# EasyEDA Pro project Space_Hexapod.eprj, schematic Power
Board Name: Power; Create Date: 2025-05-06
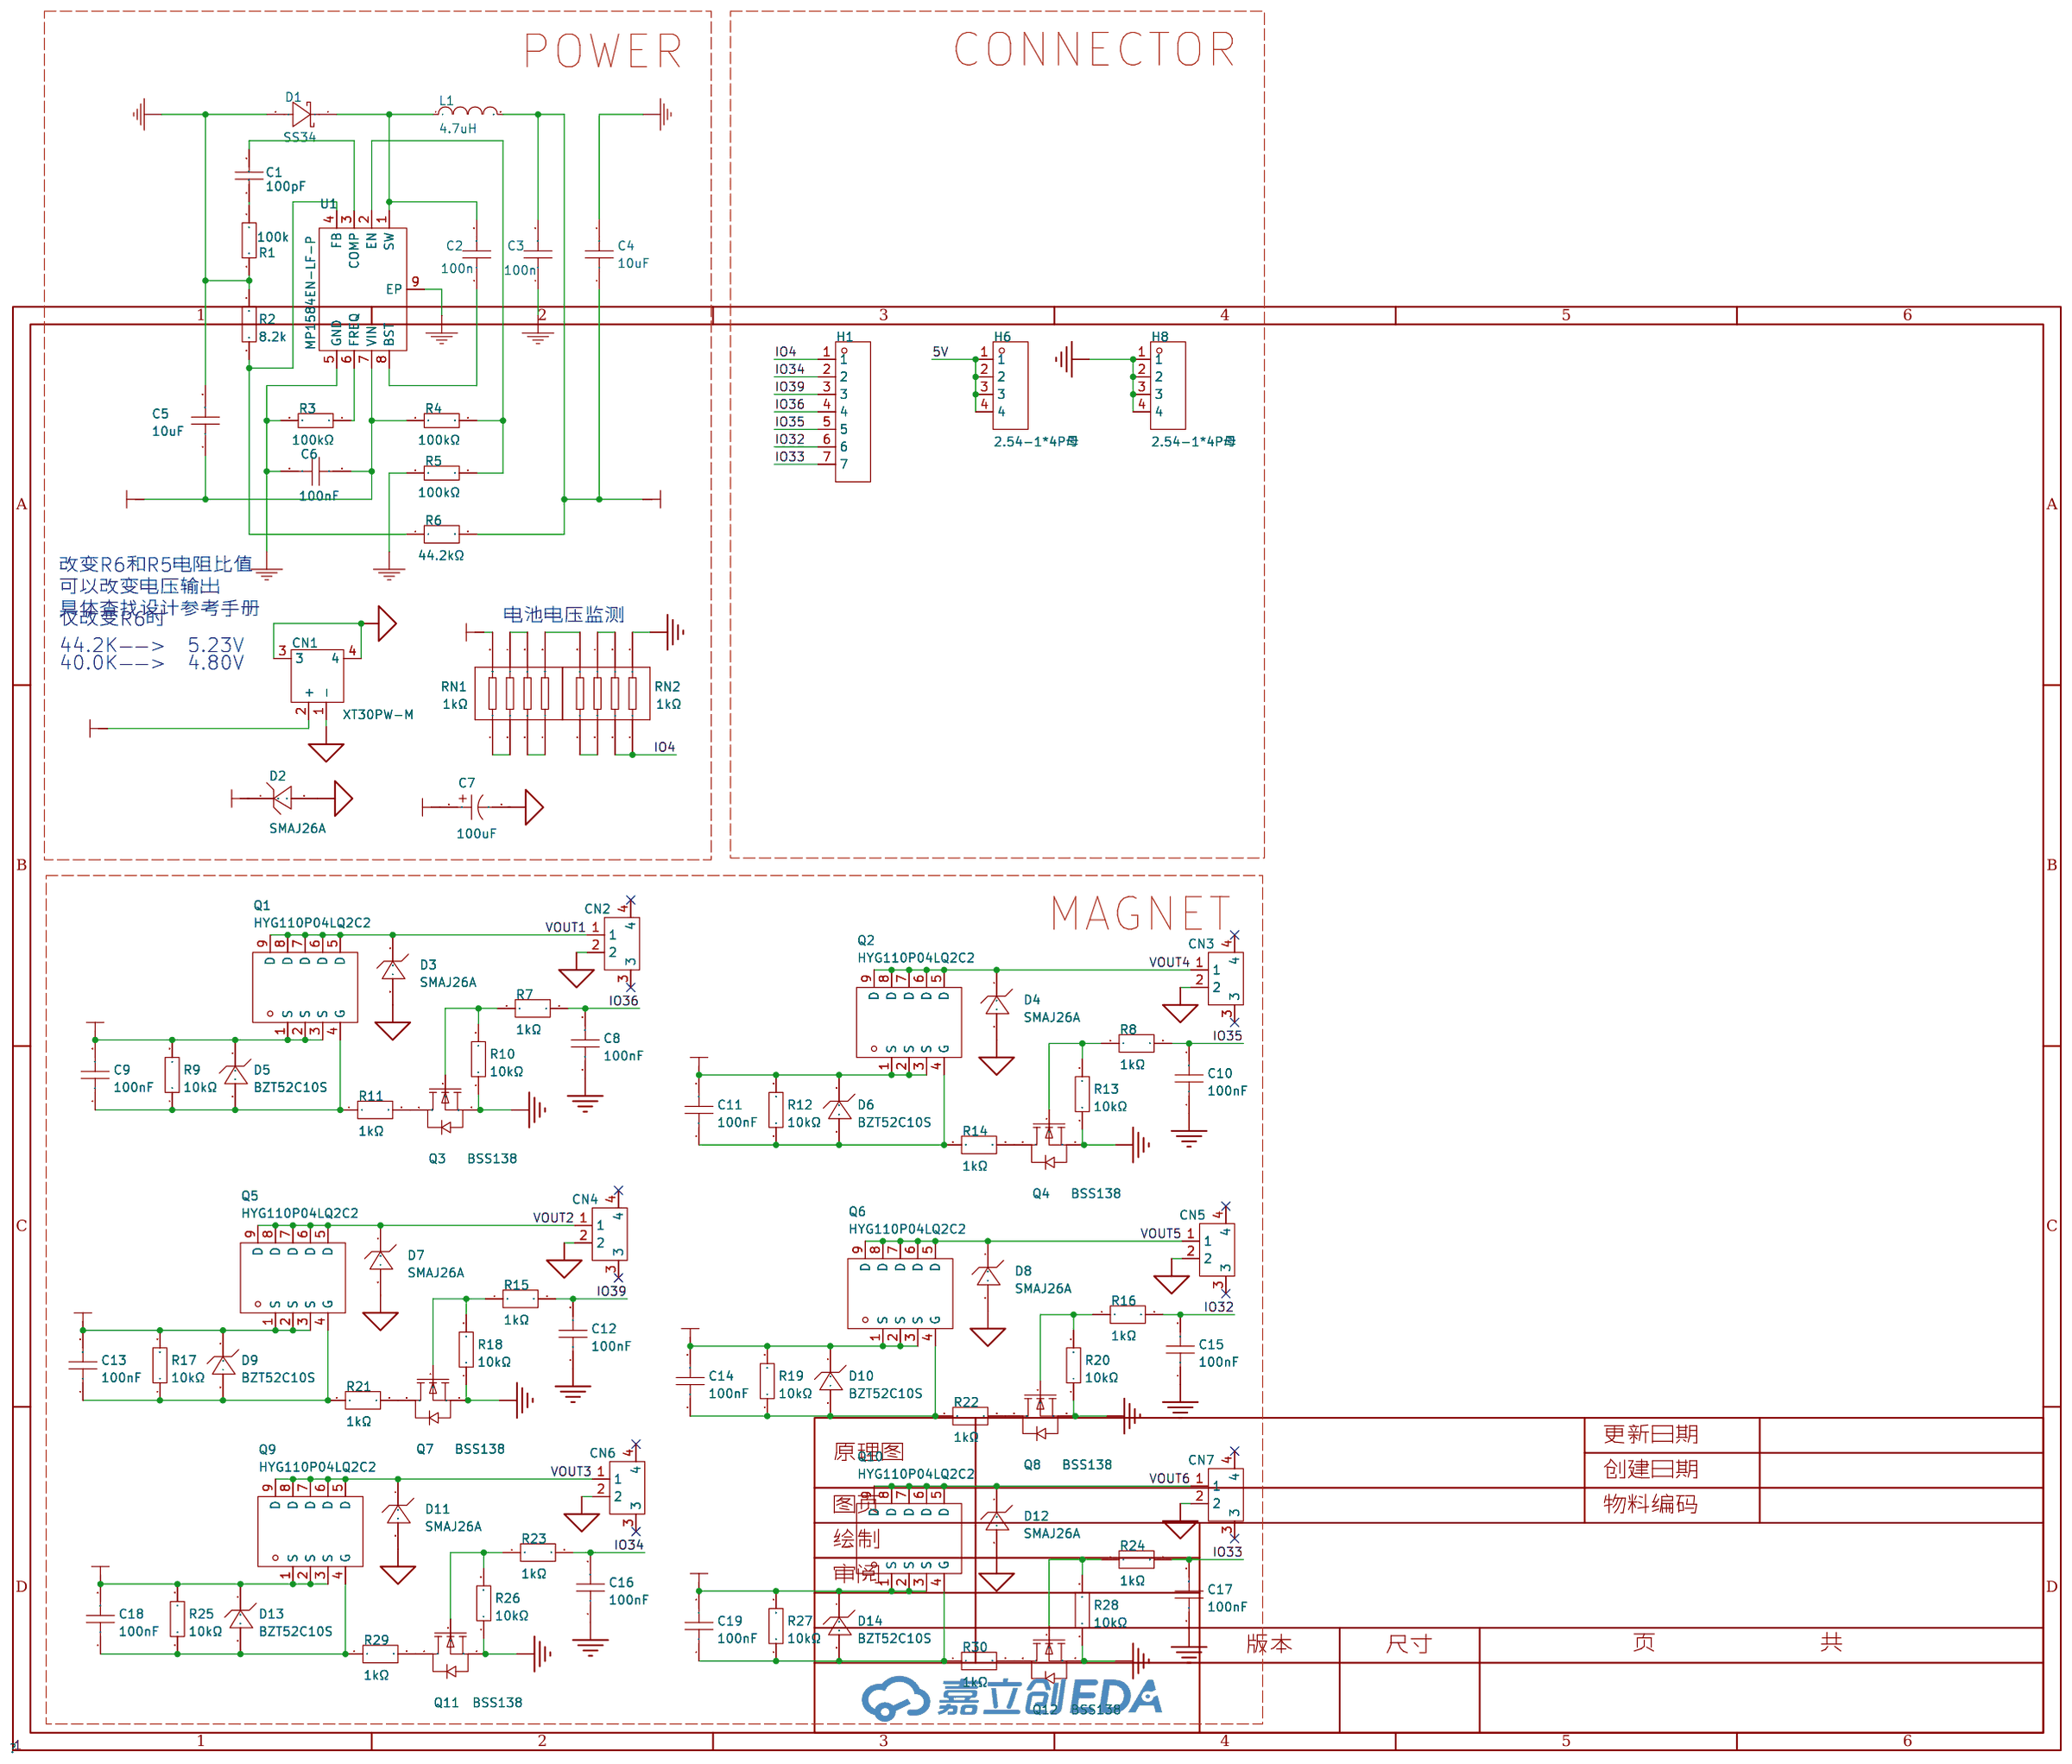
[diagram p2: schematic sheet]

## Parts
C1  100pF  [C0402]
C2  100n  [C0402]
C3  100n  [C0402]
C4  10uF  [C1206]
C5  10uF  [C1206]
C6  100nF  [C0402]
C7  100uF  [CAP-SMD_BD6.3-L6.6-W6.6-LS7.6-FD-1]
C8  100nF  [C0402]
C9  100nF  [C0402]
C10  100nF  [C0402]
C11  100nF  [C0402]
C12  100nF  [C0402]
C13  100nF  [C0402]
C14  100nF  [C0402]
C15  100nF  [C0402]
C16  100nF  [C0402]
C17  100nF  [C0402]
C18  100nF  [C0402]
C19  100nF  [C0402]
CN1  XT30PW-M  [CONN-TH_XT30PW-M]
CN2  GT-A1257WRS-102SBT01  [CONN-SMD_2P-P1.25_A1254-2AWB]
CN3  GT-A1257WRS-102SBT01  [CONN-SMD_2P-P1.25_A1254-2AWB]
CN4  GT-A1257WRS-102SBT01  [CONN-SMD_2P-P1.25_A1254-2AWB]
CN5  GT-A1257WRS-102SBT01  [CONN-SMD_2P-P1.25_A1254-2AWB]
CN6  GT-A1257WRS-102SBT01  [CONN-SMD_2P-P1.25_A1254-2AWB]
CN7  GT-A1257WRS-102SBT01  [CONN-SMD_2P-P1.25_A1254-2AWB]
D1  SS34  [SMA_L4.2-W2.7-LS5.0-RD]
D2  SMAJ26A  [SMA_L4.3-W2.6-LS5.1-RD]
D3  SMAJ26A  [SMA_L4.3-W2.6-LS5.1-RD]
D4  SMAJ26A  [SMA_L4.3-W2.6-LS5.1-RD]
D5  BZT52C10S  [SOD-323_L1.6-W1.3-LS2.7-RD]
D6  BZT52C10S  [SOD-323_L1.6-W1.3-LS2.7-RD]
D7  SMAJ26A  [SMA_L4.3-W2.6-LS5.1-RD]
D8  SMAJ26A  [SMA_L4.3-W2.6-LS5.1-RD]
D9  BZT52C10S  [SOD-323_L1.6-W1.3-LS2.7-RD]
D10  BZT52C10S  [SOD-323_L1.6-W1.3-LS2.7-RD]
D11  SMAJ26A  [SMA_L4.3-W2.6-LS5.1-RD]
D12  SMAJ26A  [SMA_L4.3-W2.6-LS5.1-RD]
D13  BZT52C10S  [SOD-323_L1.6-W1.3-LS2.7-RD]
D14  BZT52C10S  [SOD-323_L1.6-W1.3-LS2.7-RD]
H1  PM254V-11-07-H85  [HDR-TH_7P-P2.54-V-F]
H6  2.54-1*4P母  [HDR-TH_4P-P2.54-V-F]
H8  2.54-1*4P母  [HDR-TH_4P-P2.54-V-F]
L1  4.7uH  [IND-SMD_L5.9-W5.2]
Q1  HYG110P04LQ2C2  [PDFN-8_L5.2-W5.9-P1.27-LS6.2-BL]
Q2  HYG110P04LQ2C2  [PDFN-8_L5.2-W5.9-P1.27-LS6.2-BL]
Q3  BSS138  [SOT-23-3_L2.9-W1.3-P1.90-LS2.4-BR]
Q4  BSS138  [SOT-23-3_L2.9-W1.3-P1.90-LS2.4-BR]
Q5  HYG110P04LQ2C2  [PDFN-8_L5.2-W5.9-P1.27-LS6.2-BL]
Q6  HYG110P04LQ2C2  [PDFN-8_L5.2-W5.9-P1.27-LS6.2-BL]
Q7  BSS138  [SOT-23-3_L2.9-W1.3-P1.90-LS2.4-BR]
Q8  BSS138  [SOT-23-3_L2.9-W1.3-P1.90-LS2.4-BR]
Q9  HYG110P04LQ2C2  [PDFN-8_L5.2-W5.9-P1.27-LS6.2-BL]
Q10  HYG110P04LQ2C2  [PDFN-8_L5.2-W5.9-P1.27-LS6.2-BL]
Q11  BSS138  [SOT-23-3_L2.9-W1.3-P1.90-LS2.4-BR]
Q12  BSS138  [SOT-23-3_L2.9-W1.3-P1.90-LS2.4-BR]
R1  100k  [R0402]
R2  8.2k  [R0402]
R3  100kΩ  [R0402]
R4  100kΩ  [R0402]
R5  100kΩ  [R0402]
R6  44.2kΩ  [R0402]
R7  1kΩ  [R0402]
R8  1kΩ  [R0402]
R9  10kΩ  [R0402]
R10  10kΩ  [R0402]
R11  1kΩ  [R0402]
R12  10kΩ  [R0402]
R13  10kΩ  [R0402]
R14  1kΩ  [R0402]
R15  1kΩ  [R0402]
R16  1kΩ  [R0402]
R17  10kΩ  [R0402]
R18  10kΩ  [R0402]
R19  10kΩ  [R0402]
R20  10kΩ  [R0402]
R21  1kΩ  [R0402]
R22  1kΩ  [R0402]
R23  1kΩ  [R0402]
R24  1kΩ  [R0402]
R25  10kΩ  [R0402]
R26  10kΩ  [R0402]
R27  10kΩ  [R0402]
R28  10kΩ  [R0402]
R29  1kΩ  [R0402]
R30  1kΩ  [R0402]
RN1  1kΩ  [RES-ARRAY-SMD_0603-8P-L3.2-W1.6-BL]
RN2  1kΩ  [RES-ARRAY-SMD_0603-8P-L3.2-W1.6-BL]
U1  MP1584EN-LF-P  [SOIC-8_L4.9-W3.9-P1.27-LS6.0-TL-EP-1]

## Library data of the parts
C1 = GRM1555C1H101JA01D: LCSC Part Name: 100pF ±5% 50V; Supplier Part: C77177; Manufacturer: muRata(村田); Supplier Footprint: 0402; JLCPCB Part Class: 扩展库; Datasheet: https://atta.szlcsc.com/upload/public/pdf/source/20161108/1478586482814.pdf; Supplier: LCSC; Tolerance: ±5%; Voltage Rated: 50V; Temperature Coefficient: C0G
C2 C3 C6 C8-C19 = CL05B104KB54PNC: LCSC Part Name: 100nF ±10% 50V; Supplier Part: C307331; Manufacturer: SAMSUNG(三星); Supplier Footprint: 0402; JLCPCB Part Class: 基础库; Datasheet: https://atta.szlcsc.com/upload/public/pdf/source/20160218/1457707763339.pdf; Supplier: LCSC; Tolerance: ±10%; Voltage Rated: 50V; Temperature Coefficient: X7R
C4 C5 = HGC1206R5106K500NSPJ: LCSC Part Name: 10uF ±10% 50V; Supplier Part: C7432781; Manufacturer: Chinocera(华瓷); Supplier Footprint: 1206; JLCPCB Part Class: 扩展库; Datasheet: https://atta.szlcsc.com/upload/public/pdf/source/20240320/FAC3FEC40A78BC5CCCE96C232A94D860.pdf; Supplier: LCSC; Tolerance: ±10%; Voltage Rating: 50V; Temperature Coefficient: X5R
C7 = RVE100UF35V67RV0072: LCSC Part Name: 100uF ±20% 35V; Supplier Part: C2836437; Manufacturer: KNSCHA(科尼盛); Supplier Footprint: SMD,D6.3xL7.7mm; JLCPCB Part Class: 扩展库; Datasheet: https://atta.szlcsc.com/upload/public/pdf/source/20220719/B52EB46F8A1558448ED03D8B4CB3C24F.pdf; Supplier: LCSC; Tolerance: ±20%; Rated Voltage: 35V; Ripple Current: 230mA@120Hz; Equivalent Series Resistance(ESR): 600mΩ@100kHz; φD: 6.3mm; L: 7.7mm; Lifetime @ Temp: 2000hrs@105℃; Operating Temperature: -55℃~+105℃
CN1 = XT30PW-M: Socket,DCsupply,XT30,male,PIN:2; LCSC Part Name: XT30PW-M公头; Supplier Part: C431092; Manufacturer: AMASS(艾迈斯); Supplier Footprint: 插件; JLCPCB Part Class: 扩展库; Datasheet: https://atta.szlcsc.com/upload/public/pdf/source/20220222/6A9F22F7850E25B33E1BE430ADF8560B.pdf; Supplier: LCSC
CN2-CN7 = GT-A1257WRS-102SBT01: LCSC Part Name: 1x2P 间距:1.25mm 卧贴 系列:GH; Supplier Part: C22472754; Manufacturer: G-Switch(品赞); Supplier Footprint: SMD,P=1.25mm,卧贴; JLCPCB Part Class: 扩展库; Datasheet: https://atta.szlcsc.com/upload/public/pdf/source/20240627/75A26D668C205D3B3111536D424D50B7.pdf; Supplier: LCSC; Pins Structure: 1x2P; Pitch: 1.25mm; Mounting Type: 卧贴; Reference Series: GH; Number of Pins: 2P; Number of Rows: 1; Number of PINs Per Row: 2; Current Rating: 1A; Contact Material: 磷青铜; Contact Plating: 锡; Operating Temperature: -25℃~+85℃; Voltage Rating: 50V; Plastic Material: LCP; Flame Retardant Rating: UL94V-0; Color: 本色; Z-Height of the Board: 4.25mm
D1 = SS34_C2891718: LCSC Part Name: 电压:40V 电流:3A; Supplier Part: C2891718; Manufacturer: KUU; Supplier Footprint: SMA(DO-214AC); JLCPCB Part Class: 扩展库; Datasheet: https://atta.szlcsc.com/upload/public/pdf/source/20210901/43FECDC7C0D2D5B6002302D3612B6747.pdf; Supplier: LCSC; Forward Voltage (Vf@If): 550mV@3A; Reverse Voltage (Vr): 40V; Average Rectified Current (Io): 3A; Reverse Leakage Current (Ir): 500uA@40V
D2-D4 D7 D8 D11 D12 = SMAJ26A_C2848697: 反向截止电压(Vrwm):26V;最大钳位电压:42.1V;峰值脉冲电流(Ipp)@10/1000us:9.5A;击穿电压:28.9V;; LCSC Part Name: 单向TVS 26V截止 9.5A峰值脉冲; Supplier Part: C2848697; Manufacturer: GOODWORK(固得沃克); Supplier Footprint: SMA(DO-214AC); JLCPCB Part Class: 扩展库; Datasheet: https://atta.szlcsc.com/upload/public/pdf/source/20201231/C908757_5436EAF671B686EFC2F0DD2098F0ED89.pdf; Supplier: LCSC; Reverse Stand-Off Voltage (Vrwm): 26V; Maximum Clamping Voltage: 42.1V; Peak Pulse Current (Ipp)@10/1000us: 9.5A; Breakdown Voltage: 28.9V; Reverse Leakage Current (Ir): 5uA; Type: TVS; Check: false
D5 D6 D9 D10 D13 D14 = BZT52C10S_C353563: 二极管配置:独立式;稳压值(标称值):10V;稳压值(范围):9.4V~10.6V;功率:200mW;精度:-;; LCSC Part Name: 齐纳二极管 10V 200mW; Supplier Part: C353563; Manufacturer: 晶导微电子; Supplier Footprint: SOD-323; JLCPCB Part Class: 扩展库; Datasheet: https://atta.szlcsc.com/upload/public/pdf/source/20190315/C353563_3561759C765052AF368552CF3A49B126.pdf; Supplier: LCSC; Diode Configuration: 独立式; Zener Voltage (Nom): 10V; Reverse Leakage Current (Ir): 200nA@7V; Zener Voltage (Range): 9.4V~10.6V; Power Dissipation: 200mW; Zener Impedance (Zzt): 20Ω; Check: false
H1 = PM254V-11-07-H85: LCSC Part Name: 间距:2.54mm 1x7P 直插; Supplier Part: C2832270; Manufacturer: XFCN(兴飞); Supplier Footprint: 插件,P=2.54mm; JLCPCB Part Class: 扩展库; Datasheet: https://atta.szlcsc.com/upload/public/pdf/source/20210514/C2832270_F424CC0071A81298BFB56B53406F9842.pdf; Supplier: LCSC; Holes Structure: 1x7P; Pitch: 2.54mm; Circular Hole / Square Hole: 方孔; Mounting Type: 直插; Number of Rows: 单排; Number of Holes: 7P; Current Rating (Max): 3A; Voltage Rating (Max): 250V; Holes Direction: 顶部; Operating Temperature Range: -40℃~+105℃
H6 H8 = 2.54-1*4P母: LCSC Part Name: 间距:2.54mm 1x4P 直插; Supplier Part: C2718488; Manufacturer: BOOMELE(博穆精密); Supplier Footprint: 插件,P=2.54mm; JLCPCB Part Class: 扩展库; Datasheet: https://atta.szlcsc.com/upload/public/pdf/source/20210301/C2718488_F4427B881E42CAA8DDB0B1C12B3A522C.pdf; Supplier: LCSC; Holes Structure: 1x4P; Pitch: 2.54mm; Circular Hole / Square Hole: 方孔; Mounting Type: 直插; Number of Rows: 单排; Number of Holes: 4P; Current Rating (Max): 3A; Holes Direction: 顶部; Contact Material: 青铜; Operating Temperature Range: -40℃~+105℃
L1 = MAPM0530F-4R7M-LF: LCSC Part Name: 4.7uH ±20%; Supplier Part: C696442; Manufacturer: microgate(麦捷科技); Supplier Footprint: SMD,5.2x5.9mm; JLCPCB Part Class: 扩展库; Datasheet: https://atta.szlcsc.com/upload/public/pdf/source/20200708/C696439_8685B867A9A56AADDA2217A0E77F6DD4.pdf; Supplier: LCSC; Tolerance: ±20%; Rated Current: 3A; DC Resistance (DCR): 85mΩ
Q1 Q2 Q5 Q6 Q9 Q10 = HYG110P04LQ2C2: 类型:1个P沟道;漏源电压(Vdss):40V;连续漏极电流(Id):55A;功率(Pd):62.5W;导通电阻(RDS(on)@Vgs,Id):9mΩ@10V,20A;阈值电压(Vgs(th)@Id):1.6V@250uA;; LCSC Part Name: 1个P沟道 耐压:40V 电流:55A; Supplier Part: C2891580; Manufacturer: HUAYI(华羿微); Supplier Footprint: PDFN-8(5.9x5.2); JLCPCB Part Class: 扩展库; Datasheet: https://atta.szlcsc.com/upload/public/pdf/source/20210918/C2891580_F8AA530E8886F11C9EBC9E8EFD99D4C1.pdf; Supplier: LCSC; Type: 1个P沟道; Drain Source Voltage (Vdss): 40V; Continuous Drain Current (Id): 55A; Power Dissipation (Pd): 62.5W; Drain Source On Resistance (RDS(on)@Vgs,Id): 9mΩ@10V,20A; Gate Threshold Voltage (Vgs(th)@Id): 1.6V@250uA; Total Gate Charge (Qg@Vgs): 76nC@10V; Input Capacitance (Ciss@Vds): 4.468nF@25V; Reverse Transfer Capacitance (Crss@Vds): 140pF@25V; Operating Temperature: -55℃~+175℃@(Tj); Check: false
Q3 Q4 Q7 Q8 Q11 Q12 = BSS138_C7420339: LCSC Part Name: N沟道,电流:340mA,耐压:50V; Supplier Part: C7420339; Manufacturer: 宏嘉诚; Supplier Footprint: SOT-23; JLCPCB Part Class: 扩展库; Datasheet: https://atta.szlcsc.com/upload/public/pdf/source/20250106/6679E24F3D42D0BF4A4F6E14986335A4.pdf; Supplier: LCSC; Type: 1个N沟道; Drain to Source Voltage: 50V; Current - Continuous Drain(Id): 340mA; RDS(on): 2.5Ω@10V,340mA; Pd - Power Dissipation: 350mW; Gate Threshold Voltage (Vgs(th)@Id): 1.6V; Gate Charge(Qg): 1.7nC@10V; Input Capacitance(Ciss@Vds): 17.5pF@25V; Reverse Transfer Capacitance (Crss@Vds): 6.5pF@25V; Operating Temperature: -55℃~+150℃
R1 R3-R5 = 0402WGF1003TCE: LCSC Part Name: 100kΩ ±1% 62.5mW 厚膜电阻; Supplier Part: C25741; Manufacturer: UNI-ROYAL(厚声); Supplier Footprint: 0402; JLCPCB Part Class: 基础库; Datasheet: https://atta.szlcsc.com/upload/public/pdf/source/20200306/C422600_1E6D84923E4A46A82E41ADD87F860B5C.pdf; Supplier: LCSC; Type: 厚膜电阻; Tolerance: ±1%; Power(Watts): 62.5mW; Overload Voltage (Max): 50V; Temperature Coefficient: ±100ppm/℃; Operating Temperature Range: -55℃~+155℃
R2 = 0402WGF8201TCE: LCSC Part Name: 8.2kΩ ±1% 62.5mW 厚膜电阻; Supplier Part: C25924; Manufacturer: UNI-ROYAL(厚声); Supplier Footprint: 0402; JLCPCB Part Class: 扩展库; Datasheet: https://atta.szlcsc.com/upload/public/pdf/source/20200306/C422600_1E6D84923E4A46A82E41ADD87F860B5C.pdf; Supplier: LCSC; Type: 厚膜电阻; Tolerance: ±1%; Power(Watts): 62.5mW; Overload Voltage (Max): 50V; Temperature Coefficient: ±100ppm/℃; Operating Temperature Range: -55℃~+155℃
R6 = FRC0402F4422TS: LCSC Part Name: 44.2kΩ ±1% 62.5mW 厚膜电阻; Supplier Part: C2933098; Manufacturer: FOJAN(富捷); Supplier Footprint: 0402; JLCPCB Part Class: 扩展库; Datasheet: https://atta.szlcsc.com/upload/public/pdf/source/20211221/925EC7D7225764EE0046F22065062C87.pdf; Supplier: LCSC; Type: 厚膜电阻; Tolerance: ±1%; Power(Watts): 62.5mW; Voltage-Supply(Max): 50V; Temperature Coefficient: ±100ppm/℃; Operating Temperature: -55℃~+155℃
R7 R8 R11 R14-R16 R21-R24 R29 R30 = RT0402BRD071KL: LCSC Part Name: 薄膜电阻 1kΩ ±0.1% 62.5mW; Supplier Part: C852624; Manufacturer: YAGEO(国巨); Supplier Footprint: 0402; JLCPCB Part Class: 扩展库; Datasheet: https://atta.szlcsc.com/upload/public/pdf/source/20210609/C852624_9EB141A274604F87C6BB037C8019D50A.pdf; Supplier: LCSC; Type: 薄膜电阻; Tolerance: ±0.1%; Power(Watts): 62.5mW; Overload Voltage (Max): 50V; Temperature Coefficient: ±25ppm/℃; Operating Temperature Range: -55℃~+155℃
R9 R10 R12 R13 R17-R20 R25-R28 = 0402WGF1002TCE: LCSC Part Name: 10kΩ ±1% 62.5mW 厚膜电阻; Supplier Part: C25744; Manufacturer: UNI-ROYAL(厚声); Supplier Footprint: 0402; JLCPCB Part Class: 基础库; Datasheet: https://atta.szlcsc.com/upload/public/pdf/source/20200306/C422600_1E6D84923E4A46A82E41ADD87F860B5C.pdf; Supplier: LCSC; Type: 厚膜电阻; Tolerance: ±1%; Power(Watts): 62.5mW; Overload Voltage (Max): 50V; Temperature Coefficient: ±100ppm/℃; Operating Temperature Range: -55℃~+155℃
RN1 RN2 = RC-ML08W102JT: LCSC Part Name: 1kΩ ±5%; Supplier Part: C160614; Manufacturer: FH(风华); Supplier Footprint: 0603x4; JLCPCB Part Class: 扩展库; Datasheet: https://atta.szlcsc.com/upload/public/pdf/source/20140224/1457706855019.pdf; Supplier: LCSC; Number of Resistors: 4; Tolerance: ±5%; Power(Watts): 62.5mW; Temperature Coefficient: ±100ppm/℃; Number of Pins: 8
U1 = MP1584EN-LF-P: LCSC Part Name: 3A，1.5MHz，28V降压转换器; Supplier Part: C7304223; Manufacturer: MPS(芯源); Supplier Footprint: SOIC-8-EP; JLCPCB Part Class: 扩展库; Datasheet: https://atta.szlcsc.com/upload/public/pdf/source/20240130/9891F7686D244BAC2C15FBD735CECA53.pdf; Supplier: LCSC; Function: 降压型; Output Type: 可调; Input Voltage: 4.5V~28V; Output Voltage: 800mV~25V; Output Current: 3A; Switching Frequency: 1.5MHz; Operating Temperature: -20℃~+125℃@(TJ); Synchronous Rectification: 否; Number of Outputs: 1; Topology: 降压式; Switch tube (built-in/external): 内置

## Nets
5V: C3.2 C4.1 H6.1 H6.2 H6.3 H6.4 L1.2 R6.2
GND: C3.1 C4.2 C5.2 C6.1 C7.2 C8.1 C10.1 C12.1 C15.1 C16.1 C17.1 CN1.1(-) CN1.3 CN1.4 CN2.2 CN3.2 CN4.2 CN5.2 CN6.2 CN7.2 D1.2(A) D2.2(A) D3.2(A) D4.2(A) D7.2(A) D8.2(A) D11.2(A) D12.2(A) H8.1 H8.2 H8.3 H8.4 Q3.2(S) Q4.2(S) Q7.2(S) Q8.2(S) Q11.2(S) Q12.2(S) R1.2 R2.2 R3.2 R5.2 R10.1 R13.1 R18.1 R20.1 R26.1 R28.1 RN2.5 U1.5(GND) U1.9(EP)
VIN: C5.1 C6.2 C7.1 C9.2 C11.2 C13.2 C14.2 C18.2 C19.2 CN1.2(+) D2.1(C) D5.1(C) D6.1(C) D9.1(C) D10.1(C) D13.1(C) D14.1(C) Q1.1(S) Q1.2(S) Q1.3(S) Q2.1(S) Q2.2(S) Q2.3(S) Q5.1(S) Q5.2(S) Q5.3(S) Q6.1(S) Q6.2(S) Q6.3(S) Q9.1(S) Q9.2(S) Q9.3(S) Q10.1(S) Q10.2(S) Q10.3(S) R4.2 R9.2 R12.2 R17.2 R19.2 R25.2 R27.2 RN1.8 U1.7(VIN)
IO4: H1.1 RN2.3 RN2.4
IO32: C15.2 H1.6 R16.2
IO33: C17.2 H1.7 R24.2
IO34: C16.2 H1.2 R23.2
IO35: C10.2 H1.5 R8.2
IO36: C8.2 H1.4 R7.2
IO39: C12.2 H1.3 R15.2
VOUT1: CN2.1 D3.1(C) Q1.5(D) Q1.6(D) Q1.7(D) Q1.8(D) Q1.9(D)
VOUT2: CN4.1 D7.1(C) Q5.5(D) Q5.6(D) Q5.7(D) Q5.8(D) Q5.9(D)
VOUT3: CN6.1 D11.1(C) Q9.5(D) Q9.6(D) Q9.7(D) Q9.8(D) Q9.9(D)
VOUT4: CN3.1 D4.1(C) Q2.5(D) Q2.6(D) Q2.7(D) Q2.8(D) Q2.9(D)
VOUT5: CN5.1 D8.1(C) Q6.5(D) Q6.6(D) Q6.7(D) Q6.8(D) Q6.9(D)
VOUT6: CN7.1 D12.1(C) Q10.5(D) Q10.6(D) Q10.7(D) Q10.8(D) Q10.9(D)
$2N4222: C9.1 D5.2(A) Q1.4(G) R9.1 R11.1
$2N4227: Q3.1(G) R7.1 R10.2
$2N23262: C1.2 U1.3(COMP)
$2N23263: C1.1 R1.1
$2N23269: R2.1 R6.1 U1.4(FB)
$2N23273: C2.1 U1.8(BST)
$2N23274: R3.1 U1.6(FREQ)
$2N23279: R4.1 R5.1 U1.2(EN)
$2N23281: C2.2 D1.1(K) L1.1 U1.1(SW)
$2N23284: RN1.3 RN1.4
$2N23285: RN2.1 RN2.2
$2N23286: RN1.1 RN1.2
$2N23290: RN1.6 RN1.7
$2N23291: RN1.5 RN2.8
$2N23292: RN2.6 RN2.7
$2N31785: Q3.3(D) R11.2
$2N40147: Q7.3(D) R21.2
$2N40149: Q7.1(G) R15.1 R18.2
$2N40150: C13.1 D9.2(A) Q5.4(G) R17.1 R21.1
$2N43559: Q11.1(G) R23.1 R26.2
$2N43564: C18.1 D13.2(A) Q9.4(G) R25.1 R29.1
$2N43565: Q11.3(D) R29.2
$2N44625: Q8.1(G) R16.1 R20.2
$2N44632: Q8.3(D) R22.2
$2N44634: C14.1 D10.2(A) Q6.4(G) R19.1 R22.1
$2N47079: C11.1 D6.2(A) Q2.4(G) R12.1 R14.1
$2N47085: Q4.1(G) R8.1 R13.2
$2N47089: Q4.3(D) R14.2
$2N47612: C19.1 D14.2(A) Q10.4(G) R27.1 R30.1
$2N47618: Q12.1(G) R24.1 R28.2
$2N47622: Q12.3(D) R30.2

Not connected (* = marked no-connect by the designer): CN2 3* 4*; CN3 3* 4*; CN4 3* 4*; CN5 3* 4*; CN6 3* 4*; CN7 3* 4*

## Notes on the sheet
- POWER
- CONNECTOR
- 改变R6和R5电阻比值
  可以改变电压输出
  具体查找设计参考手册
- 仅改变R6时
- 电池电压监测
- 44.2K——>  5.23V
- 40.0K——>  4.80V
- MAGNET
